# Altium schematic sheet PowerIn.SchDoc
size A4; DocumentNumber: 1; SheetNumber: 6
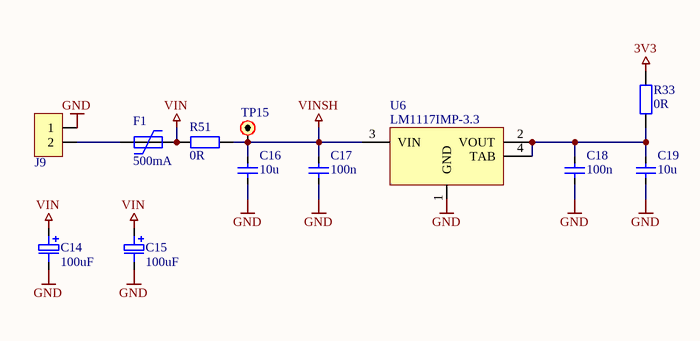
[diagram p0: PowerIn.SchDoc]

## Parts
C14  100uF  [C_EL_B_4MM_RF_M]
C15  100uF  [C_EL_B_4MM_RF_M]
C16  10u  [0805C_RF_M]
C17  100n  [0805C_RF_M]
C18  100n  [0805C_RF_M]
C19  10u  [0805C_RF_M]
F1  500mA  [BOURNS_MF-MSMF110/16-2_RF_H]
J9  PINHDR-2P1  [HEADER-2.54-2P1]  (value not drawn)
R33  0R  [1206R_RF_M]
R51  0R  [1206R_RF_M]
TP15  5V  [PAD_R_1.5MM]  (value not drawn)
U6  LM1117IMP-3.3  [SOT-223]

## Nets
3V3: R33.2
GND: C14.N C15.N C16.1 C17.1 C18.1 C19.1 J9.1 U6.1(GND)
VIN: C14.P C15.P F1.1 R51.1
VINSH: C16.2 C17.2 R51.2 TP15.1 U6.3(VIN)
NetC18_2: C18.2 C19.2 R33.1 U6.2(VOUT) U6.4(TAB)
NetF1_2: F1.2 J9.2

## Notes on the sheet
- Author
- Date
- Revision
- Size
- A4
- Sheet
- of

## Library data of the parts
C14 C15 = C-P: Polarized Capacitor; Manufacturer: Generic Brand; Max Voltage: ? V; Value: 100uF; Mounting Technology: SMT; Tolerance: ?; Tag: *; Manufacturer Part No: *; Supplier: *; Supplier Link: http://; Supplier Part No: *; Category: Capacitor
C16-C19 = C: Capacitor; Manufacturer: Generic Brand; Max Voltage: ? V; Tolerance: ?; Mounting Technology: SMT; Tag: *; Manufacturer Part No: *; Supplier: *; Supplier Link: http://; Supplier Part No: *; Category: Capacitor
  C16 C19: Value: 10u
  C17 C18: Value: 100n
F1 = PPTC: Resettable Fuse; Manufacturer: Generic Brand; Max Voltage: ? V; Hold Current: 500mA; Category: Fuse; Mounting Technology: SMT; Supplier Link: http://
J9 = PINHDR-2P1: Pin Header Single Row 2 Positions; Mounting Technology: THT
R33 R51 = R: Resistor; Manufacturer: Generic Brand; Power Rating: ? W; Max Voltage: ? V; Value: 0R; Tolerance: ?; Supplier Link: http://; Category: Resistor; Mounting Technology: SMT
TP15 = Test Point: Test Point / Pad
U6 = LM1117: Voltage Regulator Linear 1% 800mA SOT-223; Manufacturer: Texas Instruments; VIN_MAX: +15V; VOUT: +3.3V; Case: SOT-223; Product Number: LM1117IMP-3.3; Supplier: Chipdip; Supplier Link: https://www.chipdip.by/product/lm1117imp-3.3-nopb-2; Supplier Part No: 5641124530; Mounting Type: SMT